# EasyEDA Pro project ProProject_2.4G Wireless_2024-12-04.epro, schematic 2.4g 无线接收板
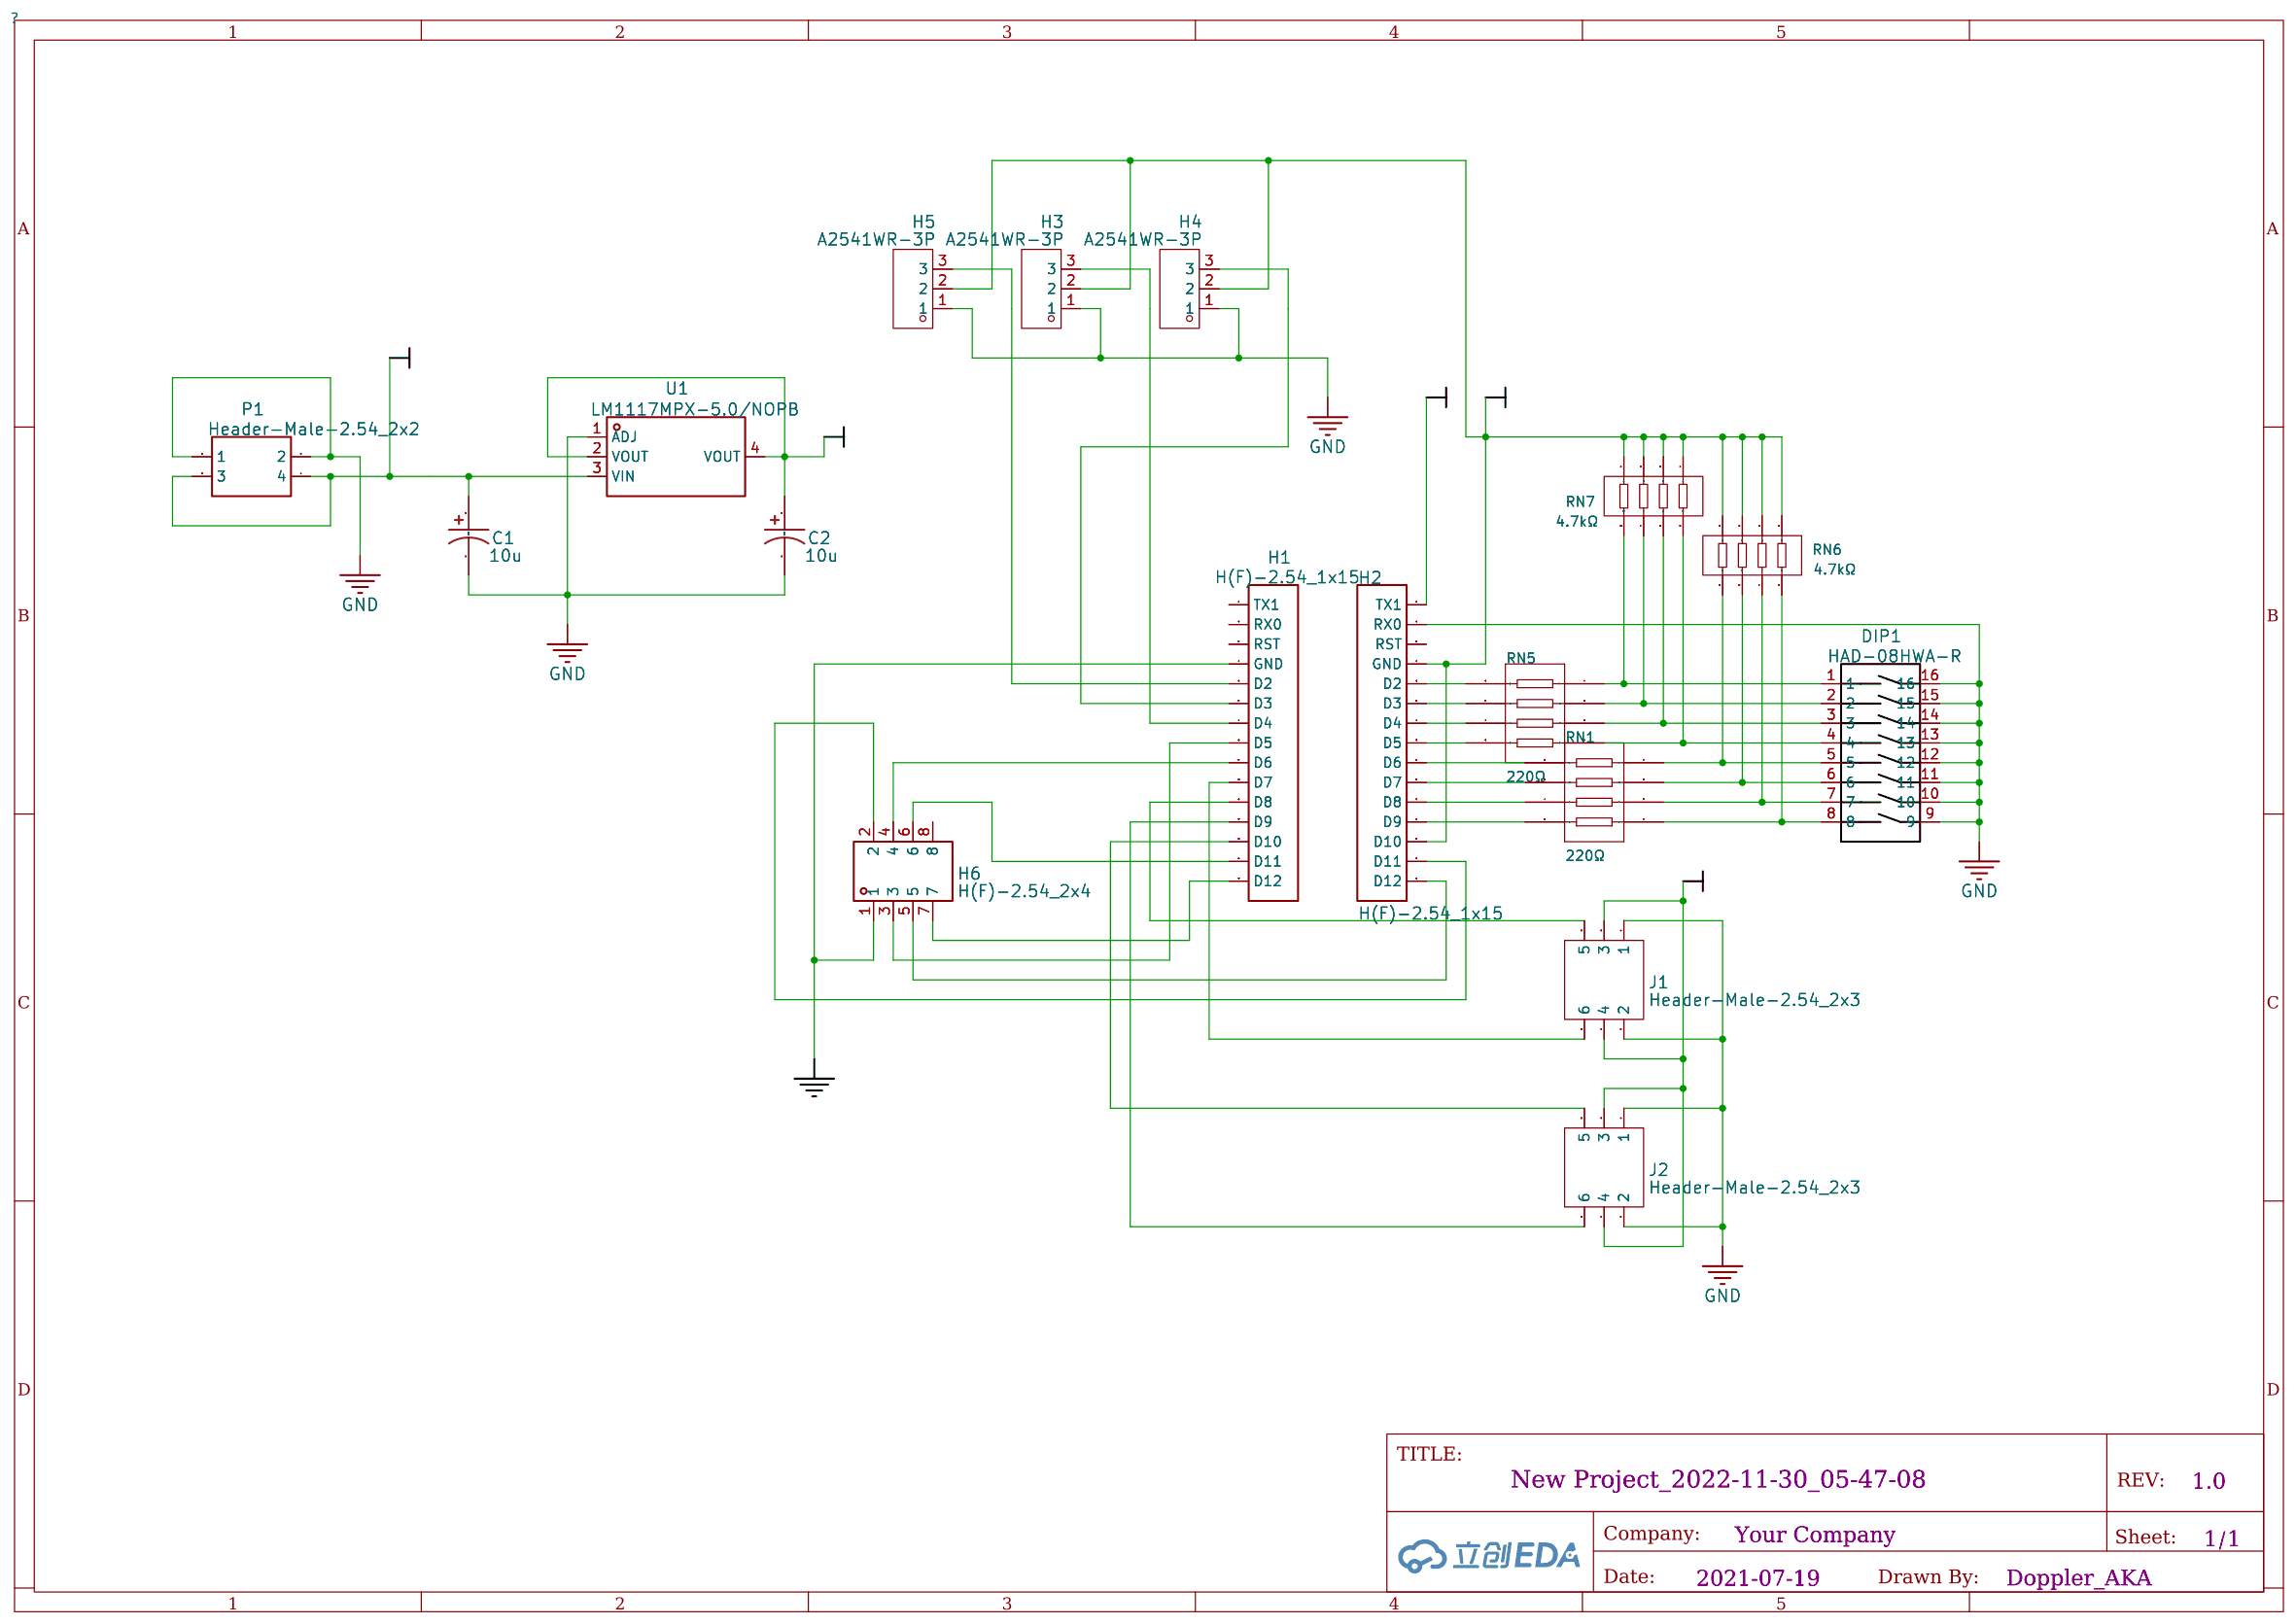
[diagram p0: schematic sheet]

## Parts
C1  10u
C2  10u
DIP1  HAD-08HWA-R
H1  H(F)-2.54_1x15
H2  H(F)-2.54_1x15
H3  A2541WR-3P
H4  A2541WR-3P
H5  A2541WR-3P
H6  H(F)-2.54_2x4
J1  Header-Male-2.54_2x3
J2  Header-Male-2.54_2x3
P1  Header-Male-2.54_2x2
RN1  220Ω  [RES-ARRAY-SMD_0804-8P-L2.0-W1.0-BL]
RN5  220Ω  [RES-ARRAY-SMD_0804-8P-L2.0-W1.0-BL]
RN6  4.7kΩ  [RES-ARRAY-SMD_0402-8P-L2.0-W1.0-BL]
RN7  4.7kΩ  [RES-ARRAY-SMD_0402-8P-L2.0-W1.0-BL]
U1  LM1117MPX-5.0/NOPB

## Library data of the parts
C1 C2 = TAJA106K010RNJ: Supplier Part: C7177; Supplier: LCSC; Manufacturer: AVX
DIP1 = HAD-08HWA-R: Supplier: LCSC; Manufacturer: ReliaPro; Supplier Part: C4682
H1 H2 = 220S-1*15P H=8.5MM Ytype Gold-plated: Supplier: LCSC; Manufacturer: Ckmtw; Supplier Part: C124408; JLCPCB Part Class: Extended Part
H3-H5 = A2541WR-3P: Supplier: LCSC; Supplier Part: C225489; Manufacturer: Changjiang Connectors; JLCPCB Part Class: Extended Part
H6 = 2.54mm,2×4Double row female: Supplier Part: C58378; Supplier: LCSC; Manufacturer: ReliaPro
J1 J2 = Header-Male-2.54_2x3: Supplier: LCSC; Manufacturer: BOOMELE; Supplier Part: C65114; JLCPCB Part Class: Extended Part
P1 = Double Rows2.54mm2*2pHeaders  Pins: Supplier: LCSC; Manufacturer: BOOMELE; Supplier Part: C66690; JLCPCB Part Class: Extended Part
RN1 RN5 = CAT10-221J4LF: 阻值:220Ω;精度:±5%;单个元件功率:62.5mW;温度系数:±250ppm/℃;电阻器数:4;引脚数:8;; LCSC Part Name: 220Ω ±5%; Supplier Part: C148504; Manufacturer: BOURNS; Supplier Footprint: 0402x4; JLCPCB Part Class: Extended Part; Datasheet: https://atta.szlcsc.com/upload/public/pdf/source/20171120/C148504_15111593480311130537.pdf; Supplier: LCSC; Tolerance: ±5%; Power(Watts): 62.5mW; Temperature Coefficient: ±250ppm/℃; Number of Resistors: 4; Number of Pins: 8
RN6 RN7 = CRA024RJ4K7Q10: 阻值:4.7kΩ;精度:±5%;单个元件功率:63mW;温度系数:±200ppm/℃;电阻器数:4;引脚数:8;; LCSC Part Name: 4.7kΩ ±5%; Supplier Part: C429228; Manufacturer: EVER OHMS(天二科技); Supplier Footprint: 0402x4; JLCPCB Part Class: Extended Part; Datasheet: https://atta.szlcsc.com/upload/public/pdf/source/20190918/C429228_95F297128F696443979FCD73C42BE12D.pdf; Supplier: LCSC; Tolerance: ±5%; Power(Watts): 63mW; Temperature Coefficient: ±200ppm/℃; Number of Resistors: 4; Number of Pins: 8
U1 = LM1117MPX-5.0/NOPB: Supplier: LCSC; Manufacturer: TI; Supplier Part: C9663; JLCPCB Part Class: Extended Part

## Nets
+5V: C2.1 H2.4(GND) H2.13(D10) H3.2 H4.2 H5.2 J1.3 J1.4 J2.3 J2.4 RN6.1 RN6.2 RN6.3 RN6.4 RN7.1 RN7.2 RN7.3 RN7.4 U1.2(VOUT) U1.4(VOUT)
GND: C1.2 C2.2 DIP1.9 DIP1.10 DIP1.11 DIP1.12 DIP1.13 DIP1.14 DIP1.15 DIP1.16 H1.4(GND) H2.2(RX0) H3.1 H4.1 H5.1 H6.1 J1.1 J1.2 J2.1 J2.2 P1.1 P1.2 U1.1(ADJ)
VCC: C1.1 H2.1(TX1) P1.3 P1.4 U1.3(VIN)
Net-(DIP1-1): DIP1.1 RN5.4 RN7.8
Net-(DIP1-2): DIP1.2 RN5.3 RN7.7
Net-(DIP1-3): DIP1.3 RN5.2 RN7.6
Net-(DIP1-4): DIP1.4 RN5.1 RN7.5
Net-(DIP1-5): DIP1.5 RN1.4 RN6.5
Net-(DIP1-6): DIP1.6 RN1.3 RN6.6
Net-(DIP1-7): DIP1.7 RN1.2 RN6.7
Net-(DIP1-8): DIP1.8 RN1.1 RN6.8
Net-(H1-5): H1.5(D2) H5.3
Net-(H1-6): H1.6(D3) H4.3
Net-(H1-7): H1.7(D4) H3.3
Net-(H1-8): H1.8(D5) H6.3
Net-(H1-9): H1.9(D6) H6.4
Net-(H1-10): H1.10(D7) J1.6
Net-(H1-11): H1.11(D8) J1.5
Net-(H1-12): H1.12(D9) J2.6
Net-(H1-13): H1.13(D10) J2.5
Net-(H1-14): H1.14(D11) H6.6
Net-(H1-15): H1.15(D12) H6.7
Net-(H2-5): H2.5(D2) RN5.5
Net-(H2-6): H2.6(D3) RN5.6
Net-(H2-7): H2.7(D4) RN5.7
Net-(H2-8): H2.8(D5) RN5.8
Net-(H2-9): H2.9(D6) RN1.5
Net-(H2-10): H2.10(D7) RN1.6
Net-(H2-11): H2.11(D8) RN1.7
Net-(H2-12): H2.12(D9) RN1.8
Net-(H2-14): H2.14(D11) H6.2
Net-(H2-15): H2.15(D12) H6.5

Not connected (* = marked no-connect by the designer): H1 1(TX1) 2(RX0) 3(RST); H2 3(RST); H6 8
